# Altium project CC2530.PrjPCB
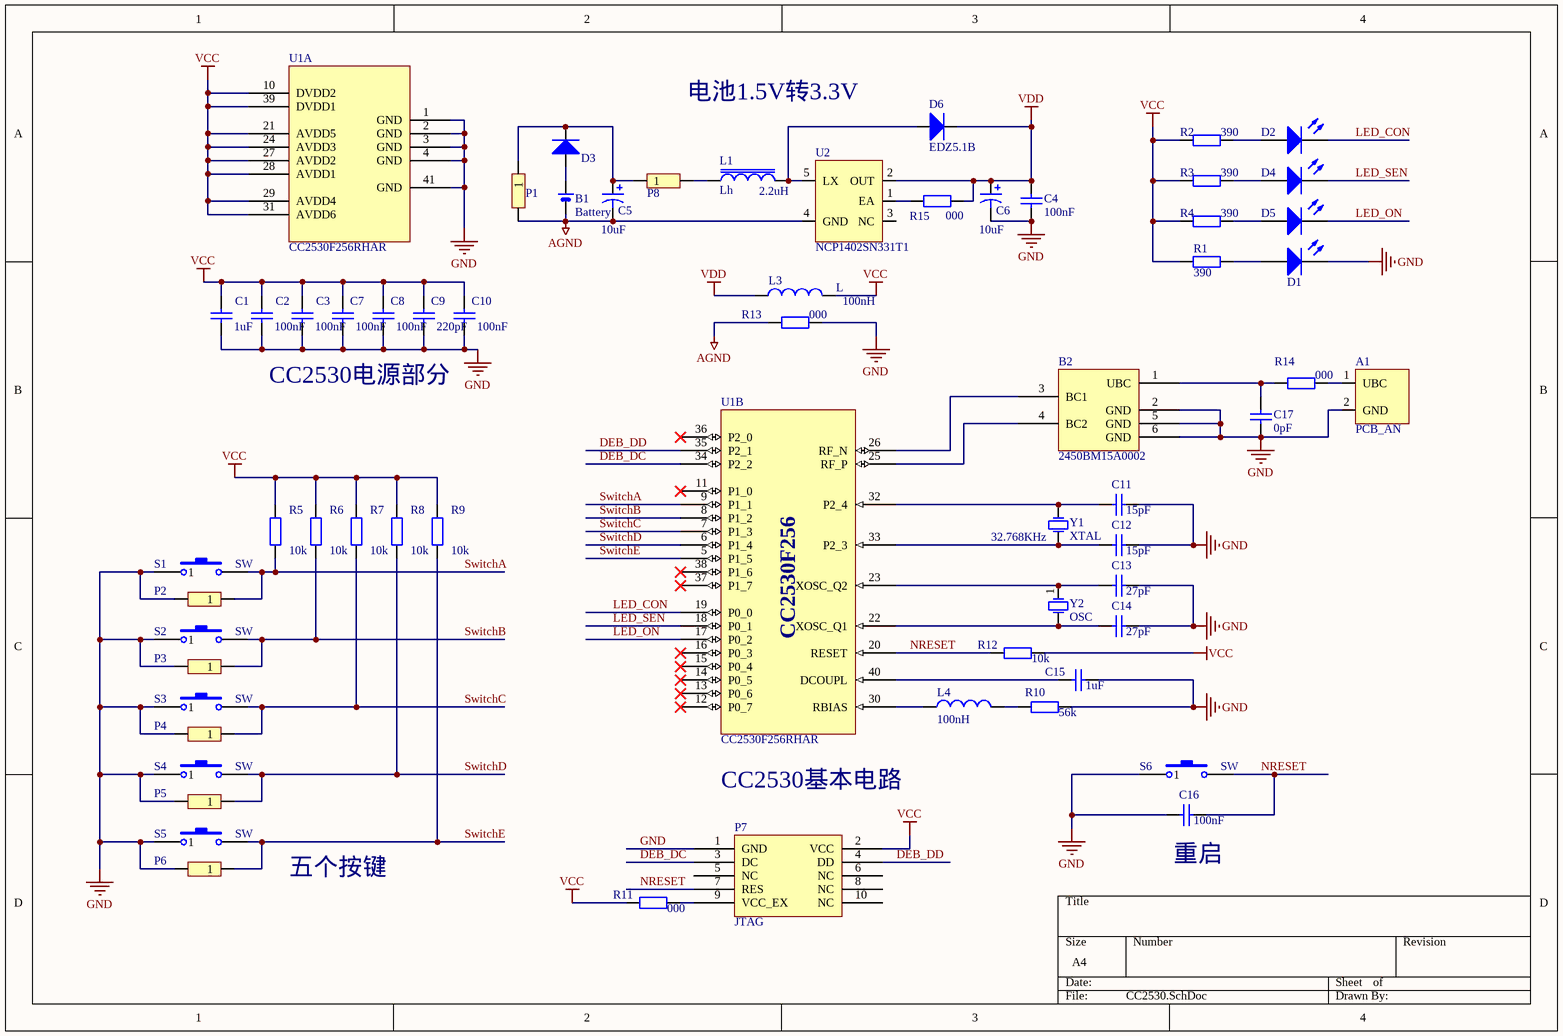
[diagram p0: CC2530.SchDoc]
1 sheet, 62 parts. Net scope: global (net labels, ports and power ports of the same name join across sheets).
Board file: CC2530.PcbDoc

## Sheet CC2530.SchDoc
size A4

### Parts
A1  PCB_AN  [AN]
B1  Battery  [Battery]
B2  2450BM15A0002  [SSOP 6]
C1  value 1uF  [0603C]  (hidden comment: C)
C2  value 100nF  [0603C]  (hidden comment: C)
C3  value 100nF  [0603C]  (hidden comment: C)
C4  value 100nF  [0603C]  (hidden comment: C)
C5  value 10uF  [1210C]  (hidden comment: DC)
C6  value 10uF  [1210C]  (hidden comment: DC)
C7  value 100nF  [0603C]  (hidden comment: C)
C8  value 100nF  [0603C]  (hidden comment: C)
C9  value 220pF  [0603C]  (hidden comment: C)
C10  value 100nF  [0603C]  (hidden comment: C)
C11  value 15pF  [0603C]  (hidden comment: C)
C12  value 15pF  [0603C]  (hidden comment: C)
C13  value 27pF  [0603C]  (hidden comment: C)
C14  value 27pF  [0603C]  (hidden comment: C)
C15  value 1uF  [0603C]  (hidden comment: C)
C16  value 100nF  [0603C]  (hidden comment: C)
C17  value 0pF  [0603C]  (hidden comment: C)
D1  LED  [0603LED]  (value not drawn)
D2  LED  [0603LED]  (value not drawn)
D3  1N40005  [0805D]  (value not drawn)
D4  LED  [0603LED]  (value not drawn)
D5  LED  [0603LED]  (value not drawn)
D6  EDZ5.1B  [SOD-523]
L1  Lh  value 2.2uH  [E(1812)]
L3  L  value 100nH  [0603R]
L4  value 100nH  [0603R]  (hidden comment: L)
P1  Head 2*1  [HEAD 2*1]  (value not drawn)
P2  Head 2*1  [HEAD 2*1]  (value not drawn)
P3  Head 2*1  [HEAD 2*1]  (value not drawn)
P4  Head 2*1  [HEAD 2*1]  (value not drawn)
P5  Head 2*1  [HEAD 2*1]  (value not drawn)
P6  Head 2*1  [HEAD 2*1]  (value not drawn)
P7  JTAG  [HEAD 2*5]
P8  Head 2*1  [HEAD 2*1]  (value not drawn)
R1  value 390  [0603R]  (hidden comment: R)
R2  value 390  [0603R]  (hidden comment: R)
R3  value 390  [0603R]  (hidden comment: R)
R4  value 390  [0603R]  (hidden comment: R)
R5  value 10k  [0603R]  (hidden comment: R)
R6  value 10k  [0603R]  (hidden comment: R)
R7  value 10k  [0603R]  (hidden comment: R)
R8  value 10k  [0603R]  (hidden comment: R)
R9  value 10k  [0603R]  (hidden comment: R)
R10  value 56k  [0603R]  (hidden comment: R)
R11  value 000  [0603R]  (hidden comment: R)
R12  value 10k  [0603R]  (hidden comment: R)
R13  value 000  [0603R]  (hidden comment: R)
R14  value 000  [0603R]  (hidden comment: R)
R15  value 000  [0603R]  (hidden comment: R)
S1  SW  [BUTTON]
S2  SW  [BUTTON]
S3  SW  [BUTTON]
S4  SW  [BUTTON]
S5  SW  [BUTTON]
S6  SW  [BUTTON]
U1  CC2530F256RHAR  [QPN 40]  (parts A,B of 2)
U2  NCP1402SN331T1  [SOT23-5]
Y1  XTAL  value 32.768KHz  [1812]
Y2  OSC  [OSC]

### Nets
AGND: B1.2(OSC2) C5.2 P1.2 R13.2 U2.4(GND)
GND: A1.2(GND) B2.2(GND) B2.5(GND) B2.6(GND) C1.2 C2.2 C3.2 C4.2 C6.2 C7.2 C8.2 C9.2 C10.2 C11.2 C12.2 C13.2 C14.2 C15.2 C16.1 C17.2 D1.2(K) P2.2 P3.2 P4.2 P5.2 P6.2 P7.1(GND) R10.1 R13.1 S1.1 S2.1 S3.1 S4.1 S5.1 S6.1 U1.1(GND) U1.2(GND) U1.3(GND) U1.4(GND) U1.41(GND)
VCC: C1.1 C2.1 C3.1 C7.1 C8.1 C9.1 C10.1 L3.2 P7.2(VCC) R1.2 R2.2 R3.2 R4.2 R5.2 R6.2 R7.2 R8.2 R9.2 R11.2 R12.1 U1.10(DVDD2) U1.21(AVDD5) U1.24(AVDD3) U1.27(AVDD2) U1.28(AVDD1) U1.29(AVDD4) U1.31(AVDD6) U1.39(DVDD1)
VDD: C4.1 C6.1 D6.2(K) L3.1 R15.1 U2.2(OUT)
DEB_DC: P7.3(DC) U1.34(P2_2)
DEB_DD: P7.4(DD) U1.35(P2_1)
LED_CON: D2.2(K) U1.19(P0_0)
LED_ON: D5.2(K) U1.17(P0_2)
LED_SEN: D4.2(K) U1.18(P0_1)
NRESET: C16.2 P7.7(RES) R12.2 S6.2 U1.20(RESET)
SwitchA: P2.1 R5.1 S1.2 U1.9(P1_1)
SwitchB: P3.1 R6.1 S2.2 U1.8(P1_2)
SwitchC: P4.1 R7.1 S3.2 U1.7(P1_3)
SwitchD: P5.1 R8.1 S4.2 U1.6(P1_4)
SwitchE: P6.1 R9.1 S5.2 U1.5(P1_5)
NetA1_1: A1.1(UBC) R14.1
NetB1_1: B1.1(OSC1) D3.1(A)
NetB2_1: B2.1(UBC) C17.1 R14.2
NetB2_3: B2.3(BC1) U1.26(RF_N)
NetB2_4: B2.4(BC2) U1.25(RF_P)
NetC5_1: C5.1 D3.2(K) P1.1 P8.1
NetC11_1: C11.1 U1.32(P2_4) Y1.2(OSC2)
NetC12_1: C12.1 U1.33(P2_3) Y1.1(OSC1)
NetC13_1: C13.1 U1.23(XOSC_Q2) Y2.1(NC)
NetC14_1: C14.1 U1.22(XOSC_Q1) Y2.3(OUT)
NetC15_1: C15.1 U1.40(DCOUPL)
NetD1_1: D1.1(A) R1.1
NetD2_1: D2.1(A) R2.1
NetD4_1: D4.1(A) R3.1
NetD5_1: D5.1(A) R4.1
NetD6_1: D6.1(A) L1.2 U2.5(LX)
NetL1_1: L1.1 P8.2
NetL4_1: L4.1 U1.30(RBIAS)
NetL4_2: L4.2 R10.2
NetP7_9: P7.9(VCC_EX) R11.1
NetR15_2: R15.2 U2.1(EA)

Not connected (* = marked no-connect by the designer): P7 5(NC) 6(NC) 8(NC) 10(NC); U1 11(P1_0)* 12(P0_7)* 13(P0_6)* 14(P0_5)* 15(P0_4)* 16(P0_3)* 36(P2_0)* 37(P1_7)* 38(P1_6)*; U2 3(NC)

### Notes on the sheet
- 电池1.5V转3.3V
- CC2530电源部分
- CC2530基本电路
- 五个按键
- (near C16) 重启
- (in symbol CC2530, part B) CC2530F256

### Library data of the parts
A1 = ANENTTA
D6 = 1N40005
U1 = CC2530
U2 = NCP1402SN331